# Altium schematic sheet LumSensor.SchDoc
size A
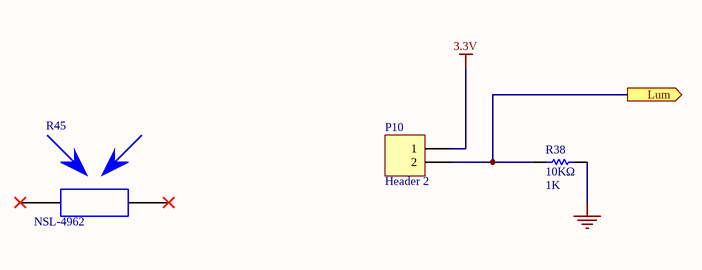
[diagram p0: LumSensor.SchDoc]

## Parts
P10  Header 2  [BORNIER]
R38  10KΩ  value 1K  [R0603]
R45  NSL-4962

## Ports
Lum (out)

## Nets
3.3V: P10.1
GND: R38.2
Lum: P10.2 R38.1 ; port Lum

Not connected (* = marked no-connect by the designer): R45 1* 2*

## Library data of the parts
P10 = Header 2: Header, 2-Pin; Manufacturer: BUCHANAN - TE CONNECTIVITY; Ref.Manufacturer: 282834-2; LatestRevisionDate: 17-Jul-2002; LatestRevisionNote: Re-released for DXP Platform.; Publisher: Altium Limited; Ref.Farnell: 2112482; Supplier: Farnell
R38 = Res1: Resistor; Manufacturer: MULTICOMP; Ref.Manufacturer: MC0063W0603110K; Published: 8-Jun-2000; LatestRevisionDate: 17-Jul-2002; LatestRevisionNote: Re-released for DXP Platform.; PackageReference: AXIAL-0.3; Publisher: Altium Limited; PackageDescription: Axial Device, Thru-Hole; 2 Leads; 0.3 in Pin Spacing; Ref.Farnell: 9330399; Supplier: Farnell
R45 = NSL-4962: Ldr; Manufacturer: ADVANCED PHOTONIX; Ref.Manufacturer: NSL 4962.; Ref.Farnell: 3168359; Supplier: Farnell